# EasyEDA Pro project 数控电源_V3.eprj, schematic 屏幕排线
Board Name: 屏幕排线; Create Date: 2025-09-15; Page Name: P1; Project Name: 数控电源_V3; Schematic Name: 屏幕排线; Update Date: 2025-09-15; Company: 嘉立创EDA; Page Size: A2; Version: V3
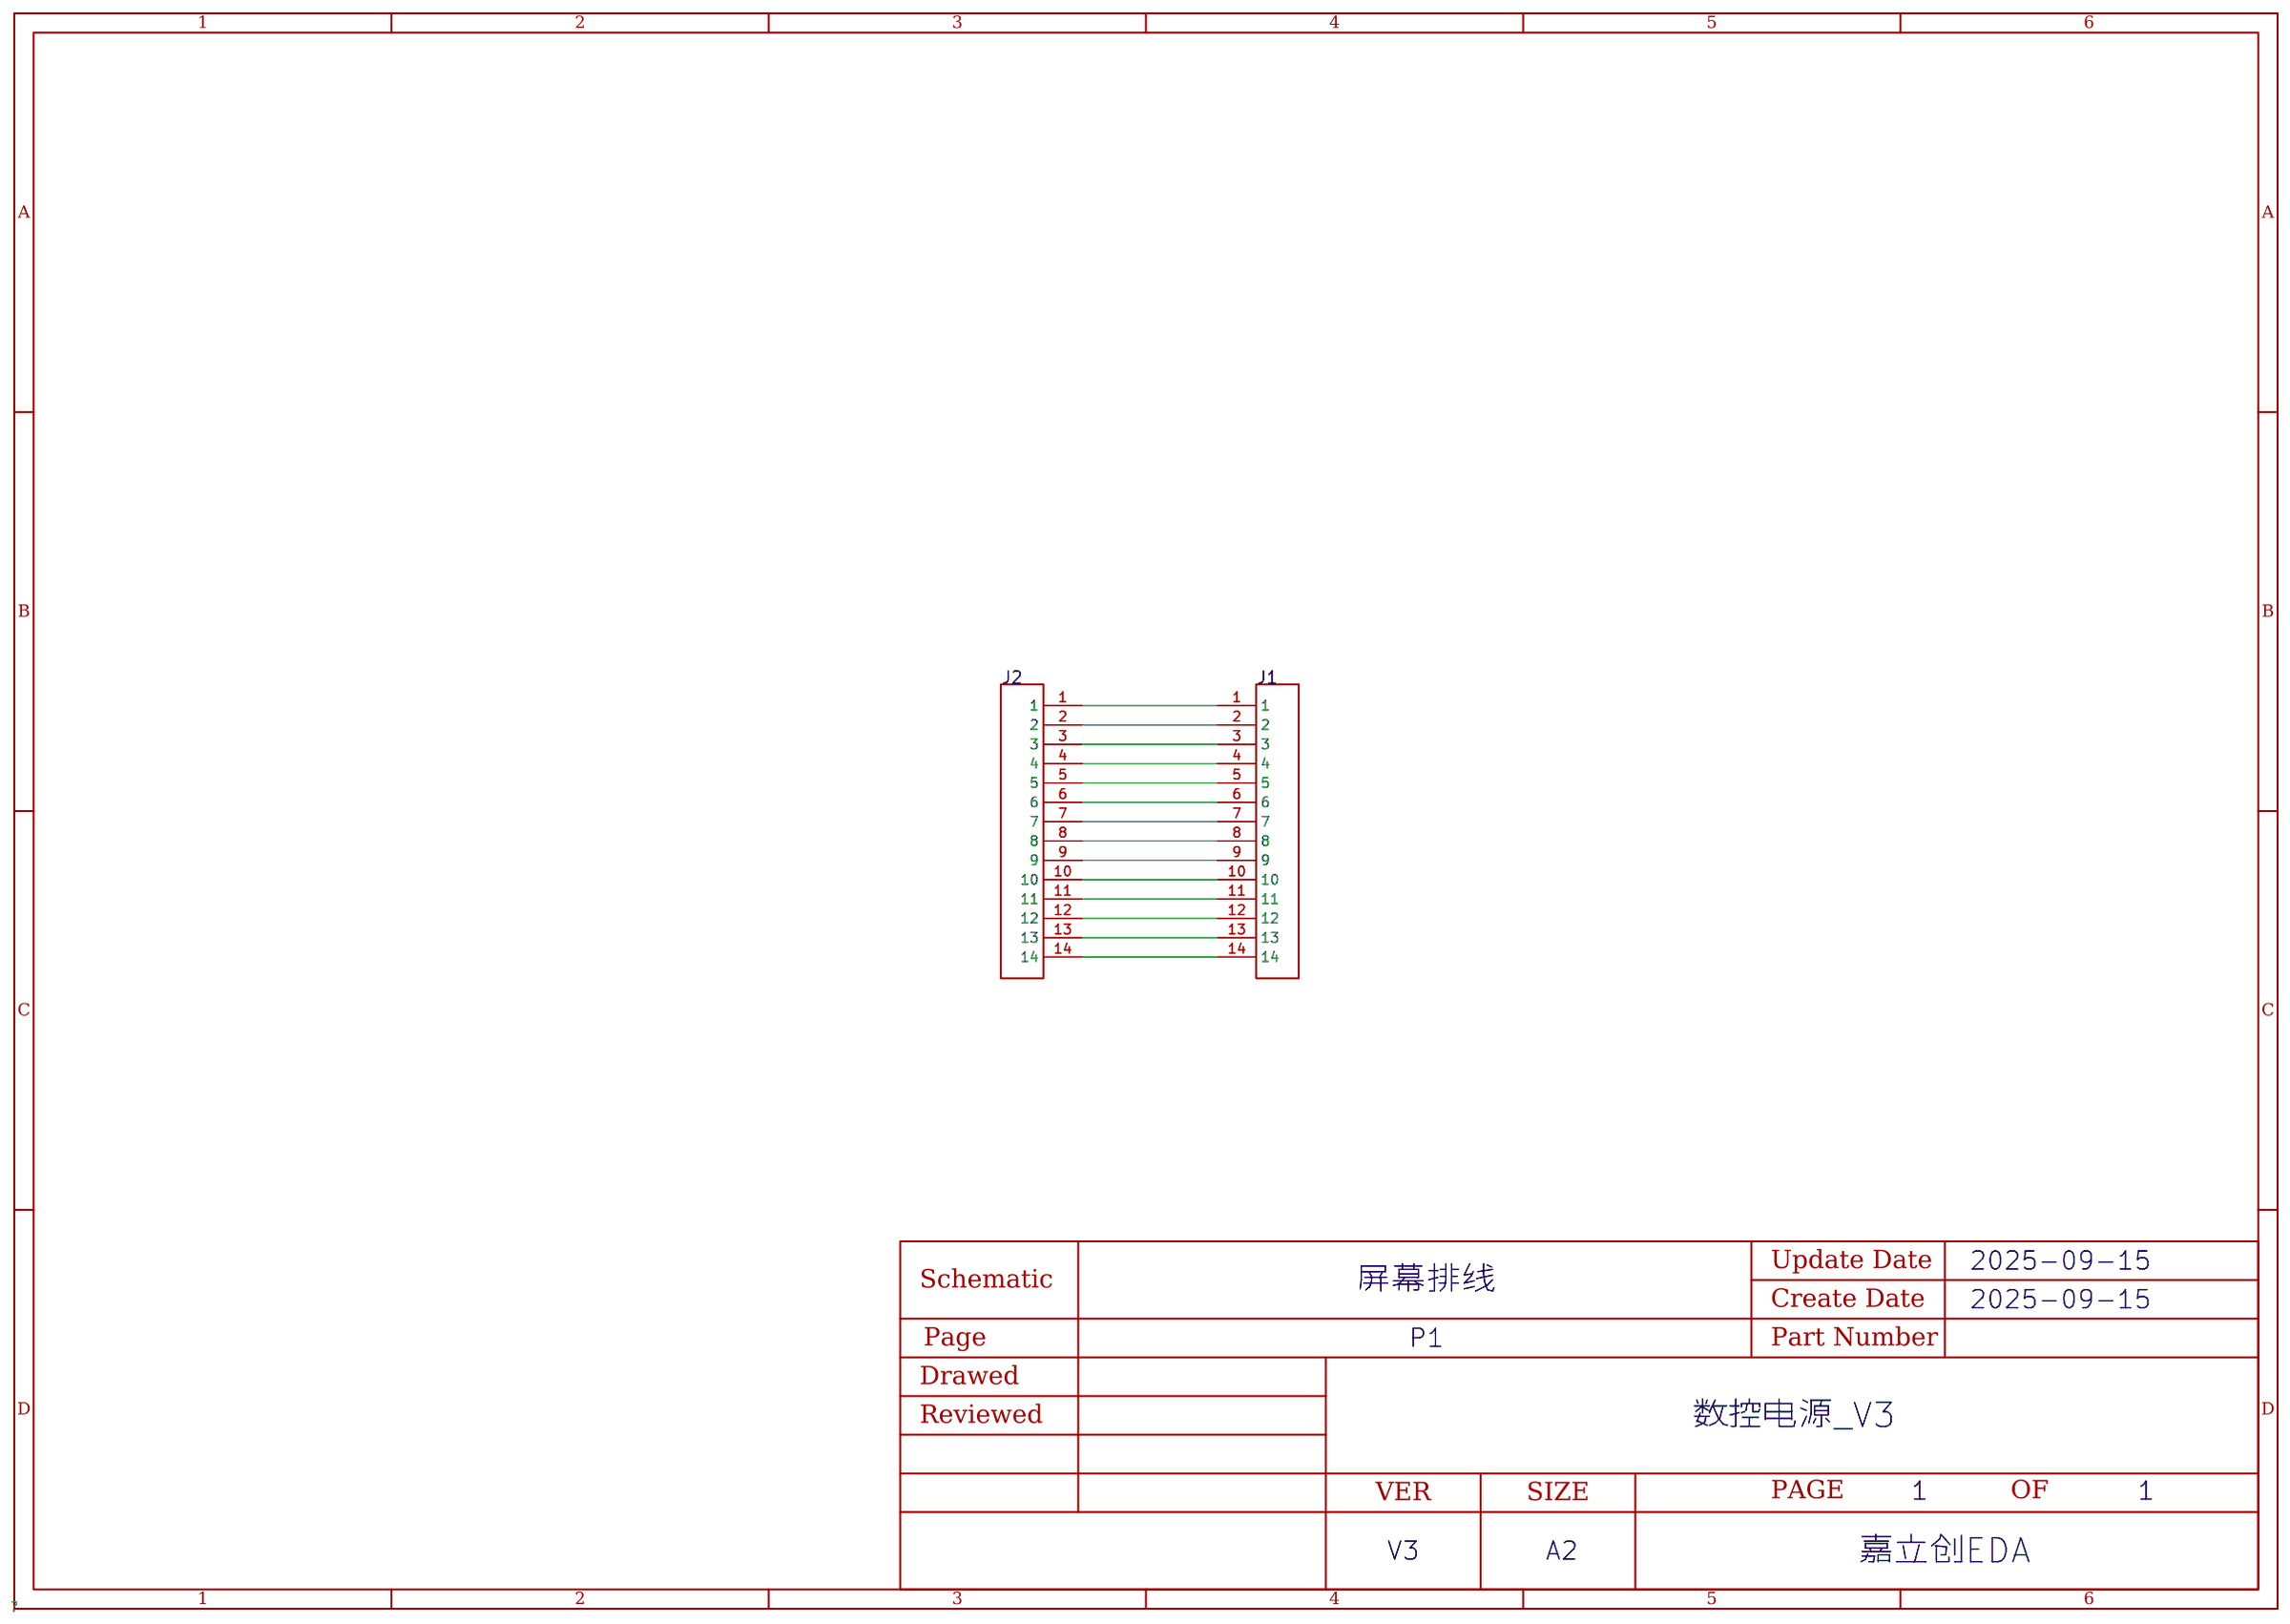
[diagram p2: schematic sheet]

## Parts
J1  -  [TFT-14PIN-0.5]
J2  -  [TFT-14PIN-0.5]

## Library data of the parts
J1 J2 = TFT-14PIN-0.5

## Nets
$1N352: J1.1 J2.1
$1N354: J1.2 J2.2
$1N356: J1.3 J2.3
$1N358: J1.4 J2.4
$1N360: J1.5 J2.5
$1N362: J1.6 J2.6
$1N364: J1.7 J2.7
$1N366: J1.8 J2.8
$1N368: J1.9 J2.9
$1N370: J1.10 J2.10
$1N372: J1.11 J2.11
$1N374: J1.12 J2.12
$1N376: J1.13 J2.13
$1N378: J1.14 J2.14
